# EAGLE design teensy_dev_board (EAGLE 8.2.1)
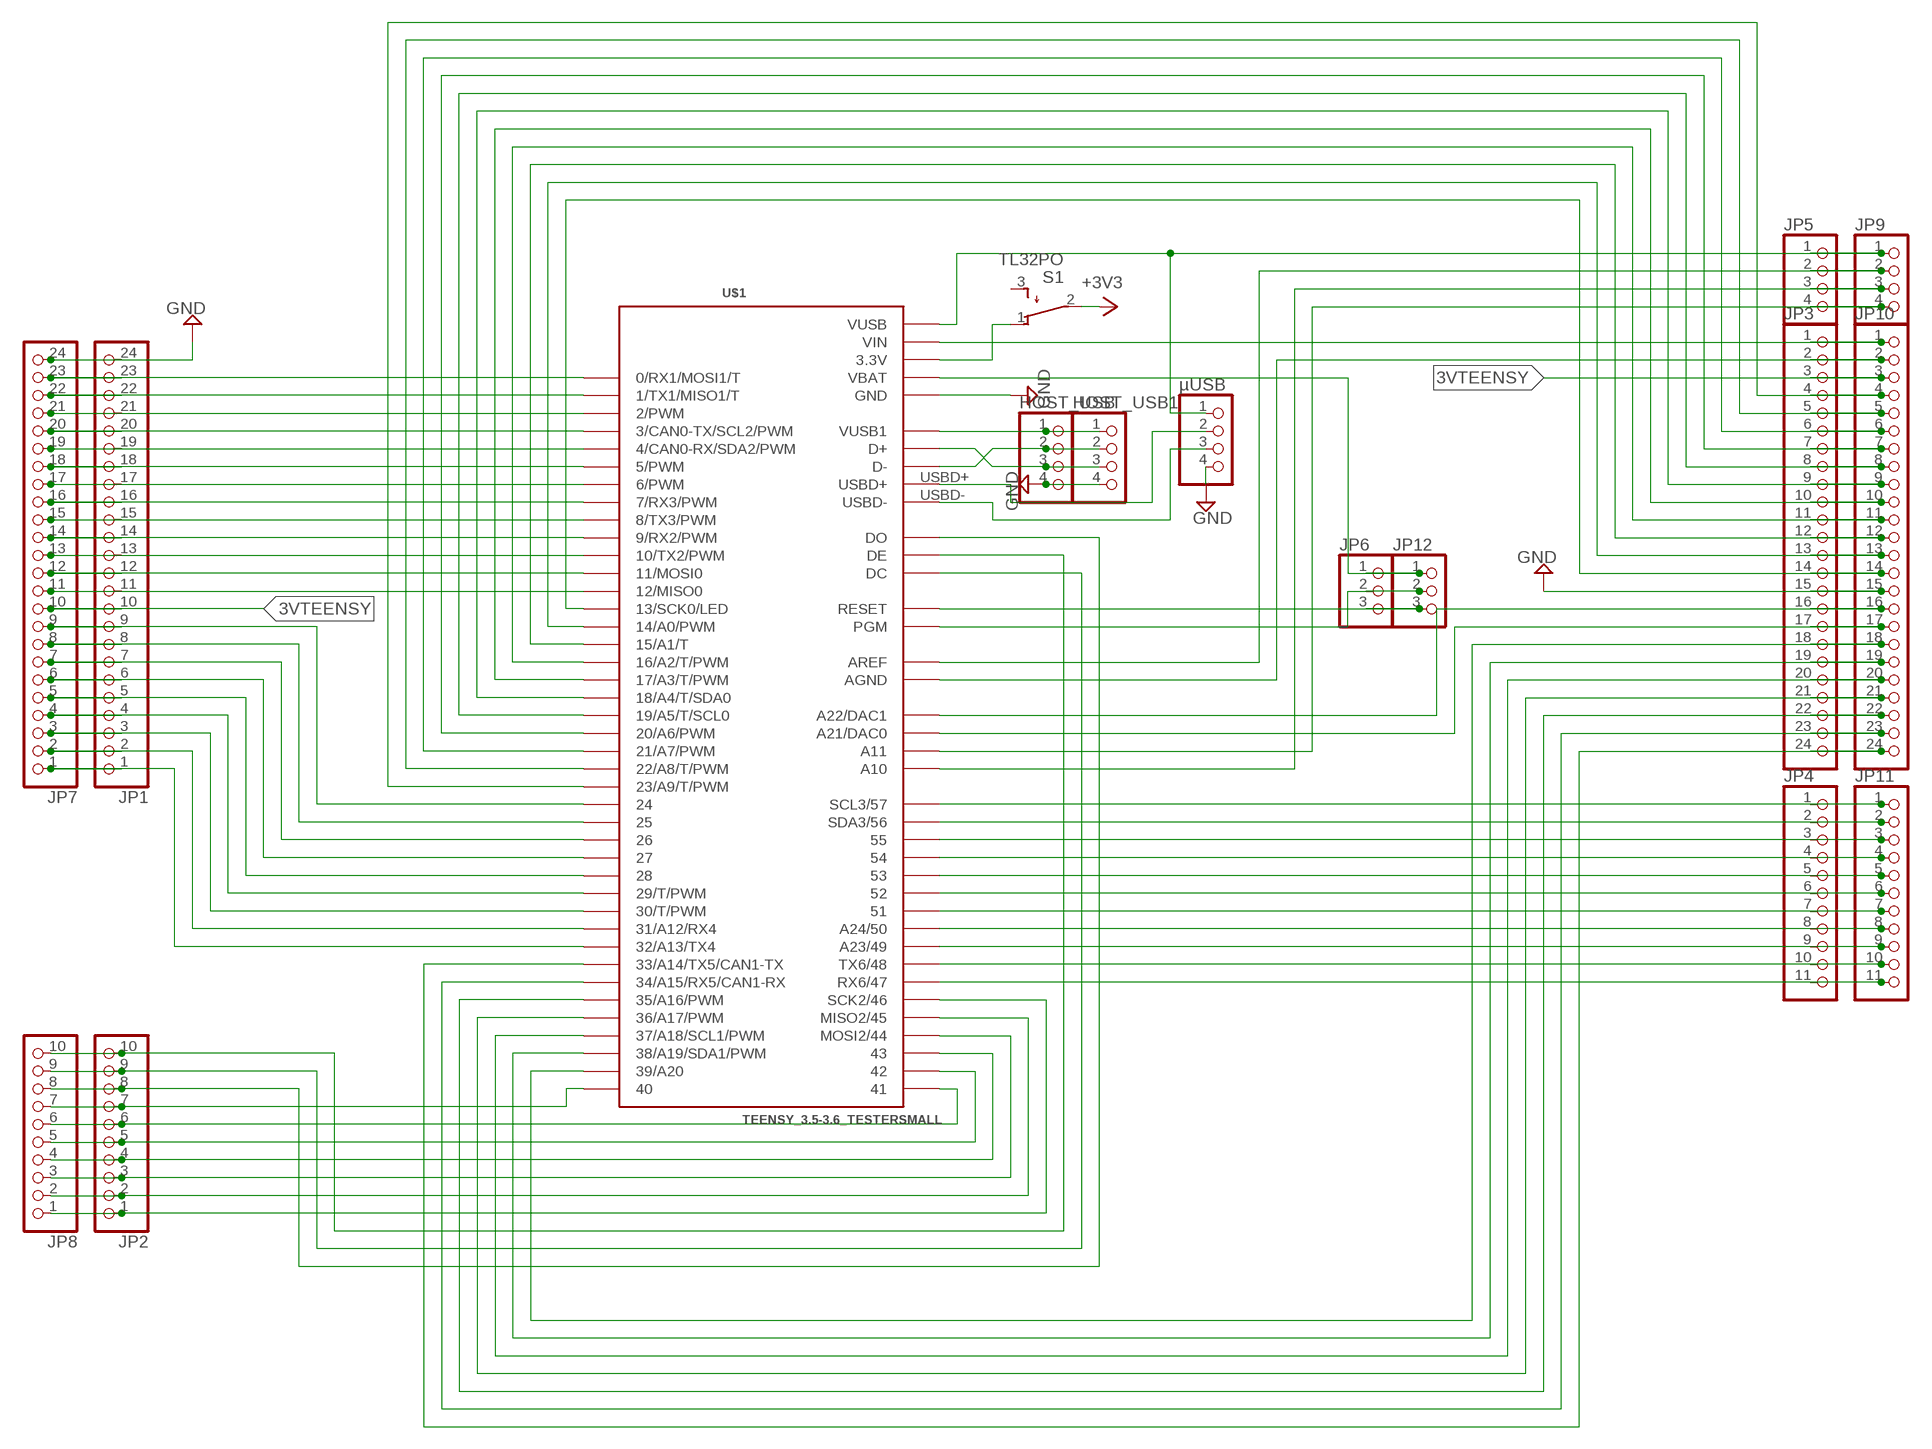
[diagram p0: schematic, sheet 1, part 1 of 2]
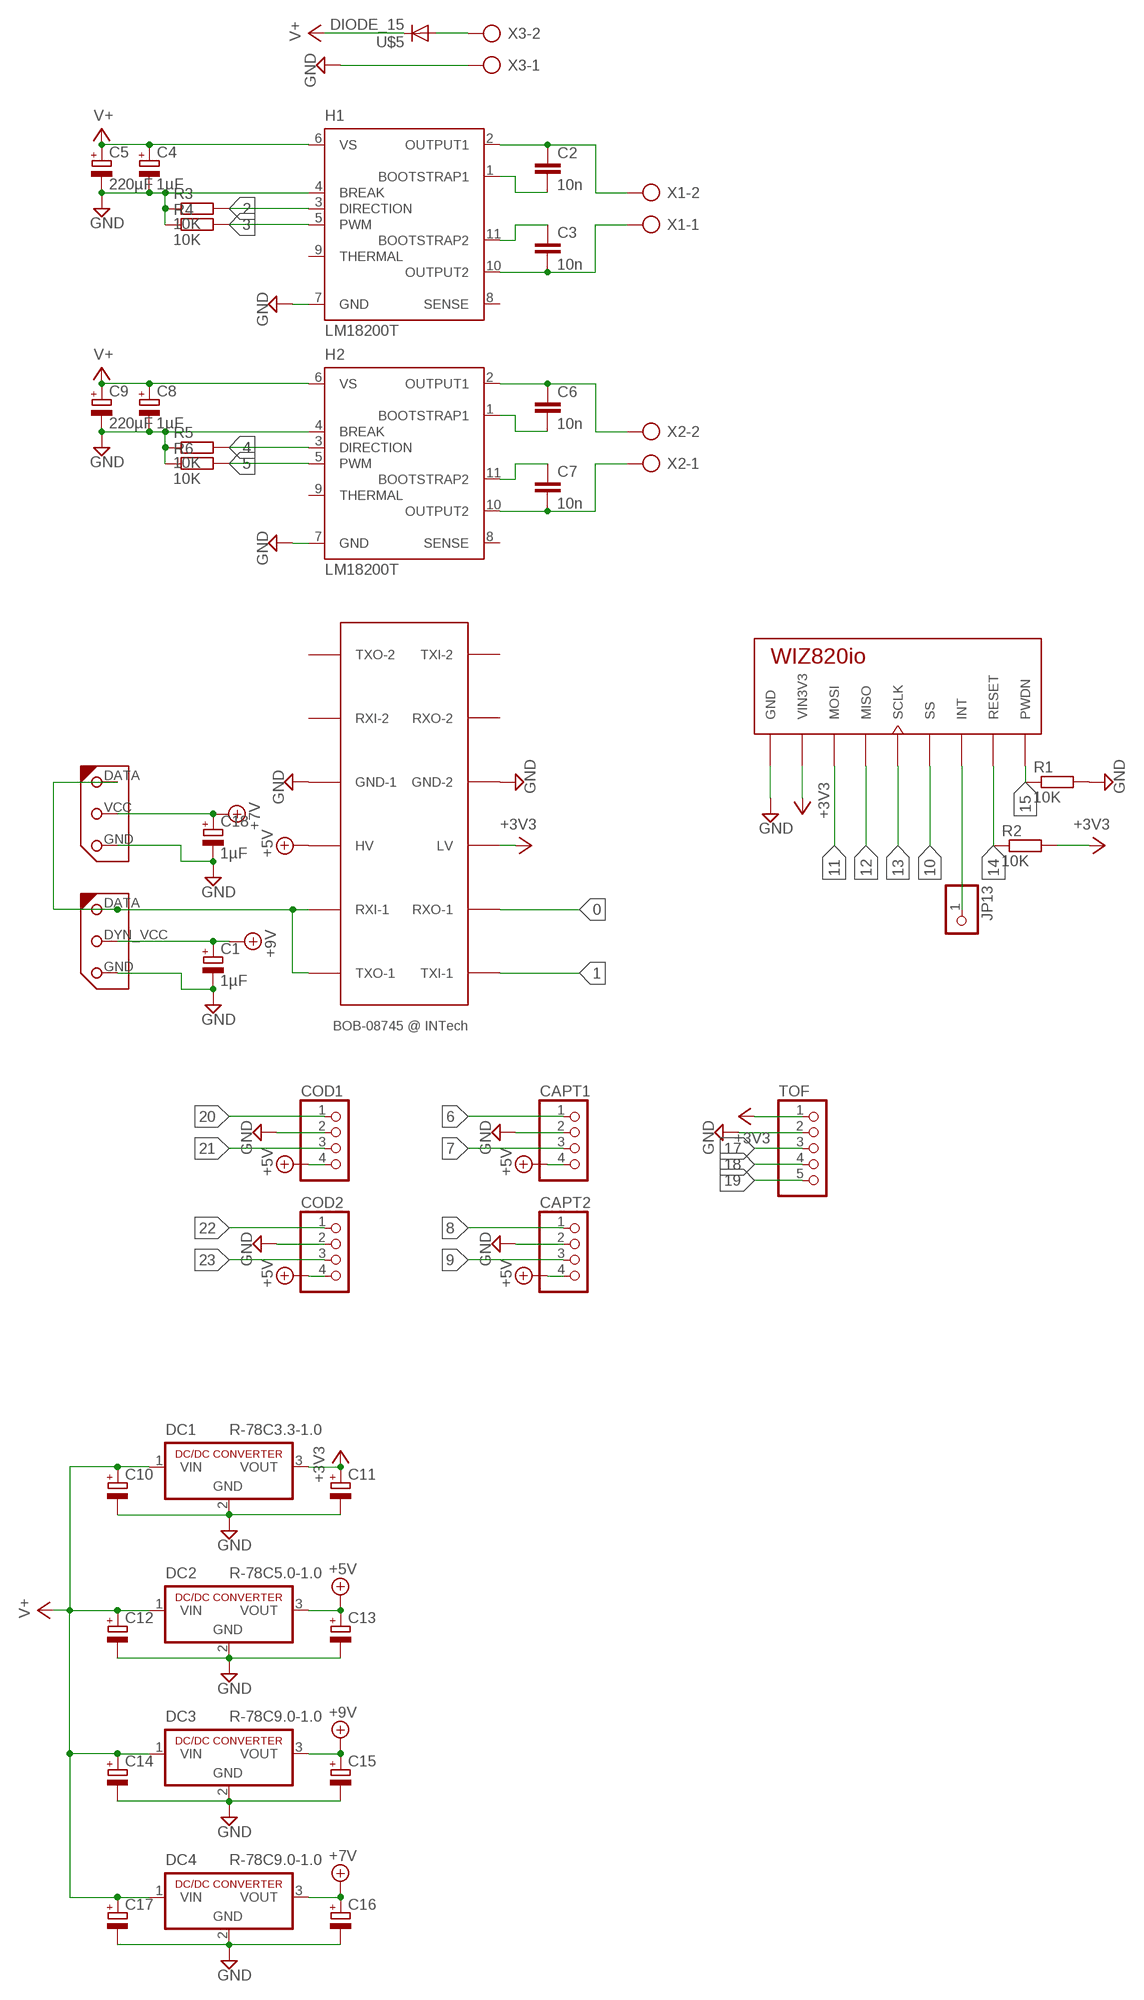
[diagram p1: schematic, sheet 1, part 2 of 2]

## Parts
C1  1µF  CPOL-EUE2,5-6E  [E2,5-6E]
C2  10n  C-EU050-025X075  [C050-025X075]
C3  10n  C-EU050-025X075  [C050-025X075]
C4  1µF  CPOL-EUE2.5-7  [E2,5-7]
C5  220µF  CPOL-EUE2.5-7  [E2,5-7]
C6  10n  C-EU050-025X075  [C050-025X075]
C7  10n  C-EU050-025X075  [C050-025X075]
C8  1µF  CPOL-EUE2.5-7  [E2,5-7]
C9  220µF  CPOL-EUE2.5-7  [E2,5-7]
C10  CPOL-EUE2.5-6  [E2,5-6]
C11  CPOL-EUE2.5-6  [E2,5-6]
C12  CPOL-EUE2.5-6  [E2,5-6]
C13  CPOL-EUE2.5-6  [E2,5-6]
C14  CPOL-EUE2.5-6  [E2,5-6]
C15  CPOL-EUE2.5-6  [E2,5-6]
C16  CPOL-EUE2.5-6  [E2,5-6]
C17  CPOL-EUE2.5-6  [E2,5-6]
C18  1µF  CPOL-EUE2,5-6E  [E2,5-6E]
CAPT1  PINHD-1X4B  [1X04B]
CAPT2  PINHD-1X4B  [1X04B]
COD1  PINHD-1X4B  [1X04B]
COD2  PINHD-1X4B  [1X04B]
DC1  R-78C3.3-1.0  [SIP3]
DC2  R-78C5.0-1.0  [SIP3]
DC3  R-78C9.0-1.0  [SIP3]
DC4  R-78C9.0-1.0  [SIP3]
H1  LM18200T  [TO-220-11]
H2  LM18200T  [TO-220-11]
HOST_USB  PINHD-1X4  [1X04]
HOST_USB1  PINHD-1X4  [1X04]
JP1  PINHD-1X24  [1X24]
JP2  PINHD-1X10  [1X10]
JP3  PINHD-1X24  [1X24]
JP4  PINHD-1X11  [1X11]
JP5  PINHD-1X4  [1X04]
JP6  PINHD-1X3  [1X03]
JP7  PINHD-1X24  [1X24]
JP8  PINHD-1X10  [1X10]
JP9  PINHD-1X4  [1X04]
JP10  PINHD-1X24  [1X24]
JP11  PINHD-1X11  [1X11]
JP12  PINHD-1X3  [1X03]
JP13  PINHD-1X1  [1X01]
R1  10K  R-EU_0204/7  [0204/7]
R2  10K  R-EU_0204/7  [0204/7]
R3  10K  R-EU_0204/7  [0204/7]
R4  10K  R-EU_0204/7  [0204/7]
R5  10K  R-EU_0204/7  [0204/7]
R6  10K  R-EU_0204/7  [0204/7]
S1  TL32PO  [TL3XPO]
TOF  PINHD-1X5B  [1X05B]
U$1  TEENSY_3.5-3.6_TESTERSMALL  [TEENSY_3.5-3.6_TESTER_SMALL]
U$2  BOB-08745  [BOB-08745]
U$3  DYNAMIXEL-1X03AX  [DYNAMIXEL_AX_1X03]
U$4  WIZ820IO  [WIZ820]
U$5  DIODE_15  [DO201-15]
U$6  DYNAMIXEL-1X03XL  [DYNAMIXEL_XL_1X03]
X1  AK300/2  [AK300/2]
X2  AK300/2  [AK300/2]
X3  AK300/2  [AK300/2]
µUSB  PINHD-1X4  [1X04]

## Nets
0: JP1.23 JP7.23 U$1.0(0/RX1/MOSI1/T) U$2.RXO-1
1: JP1.22 JP7.22 U$1.1(1/TX1/MISO1/T) U$2.TXI-1
2: H1.3(DIRECTION) JP1.21 JP7.21 R3.2 U$1.2(2/PWM)
3: H1.5(PWM) JP1.20 JP7.20 R4.2 U$1.3(3/CAN0-TX/SCL2/PWM)
3VTEENSY: JP1.10 JP3.3 JP7.10 JP10.3 S1.1(O) U$1.3.3V U$1.3.3V2(3.3V) U$1.3.3V3(3.3V) U$1.3.3V4(3.3V)
4: H2.3(DIRECTION) JP1.19 JP7.19 R5.2 U$1.4(4/CAN0-RX/SDA2/PWM)
5: H2.5(PWM) JP1.18 JP7.18 R6.2 U$1.5(5/PWM)
6: CAPT1.1 JP1.17 JP7.17 U$1.6(6/PWM)
7: CAPT1.3 JP1.16 JP7.16 U$1.7(7/RX3/PWM)
8: CAPT2.1 JP1.15 JP7.15 U$1.8(8/TX3/PWM)
9: CAPT2.3 JP1.14 JP7.14 U$1.9(9/RX2/PWM)
10: JP1.13 JP7.13 U$1.10(10/TX2/PWM) U$4.SS
11: JP1.12 JP7.12 U$1.11(11/MOSI0) U$4.MOSI
12: JP1.11 JP7.11 U$1.12(12/MISO0) U$4.MISO
13: JP3.14 JP10.14 U$1.13(13/SCK0/LED) U$4.SCLK
14: JP3.13 JP10.13 R2.1 U$1.14/A0(14/A0/PWM) U$4.RESET
15: JP3.12 JP10.12 R1.1 U$1.15/A1(15/A1/T) U$4.PWDN
16: JP3.11 JP10.11 U$1.16/A2(16/A2/T/PWM)
17: JP3.10 JP10.10 TOF.3 U$1.17/A3(17/A3/T/PWM)
18: JP3.9 JP10.9 TOF.4 U$1.18/A4(18/A4/T/SDA0)
19: JP3.8 JP10.8 TOF.5 U$1.19/A5(19/A5/T/SCL0)
20: COD1.1 JP3.7 JP10.7 U$1.20/A6(20/A6/PWM)
21: COD1.3 JP3.6 JP10.6 U$1.21/A7(21/A7/PWM)
22: COD2.1 JP3.5 JP10.5 U$1.22/A8(22/A8/T/PWM)
23: COD2.3 JP3.4 JP10.4 U$1.23/A9(23/A9/T/PWM)
24: JP1.9 JP7.9 U$1.24
25: JP1.8 JP7.8 U$1.25
26: JP1.7 JP7.7 U$1.26
27: JP1.6 JP7.6 U$1.27
28: JP1.5 JP7.5 U$1.28
29: JP1.4 JP7.4 U$1.29(29/T/PWM)
30: JP1.3 JP7.3 U$1.30(30/T/PWM)
31: JP1.2 JP7.2 U$1.31/A12(31/A12/RX4)
32: JP1.1 JP7.1 U$1.32/A13(32/A13/TX4)
33: JP3.24 JP10.24 U$1.33/A14(33/A14/TX5/CAN1-TX)
34: JP3.23 JP10.23 U$1.34/A15(34/A15/RX5/CAN1-RX)
35: JP3.22 JP10.22 U$1.35/A16(35/A16/PWM)
36: JP3.21 JP10.21 U$1.36/A17(36/A17/PWM)
37: JP3.20 JP10.20 U$1.37/A18(37/A18/SCL1/PWM)
38: JP3.19 JP10.19 U$1.38/A19(38/A19/SDA1/PWM)
39: JP3.18 JP10.18 U$1.39/A20
40: JP2.7 JP8.7 U$1.40
41: JP2.6 JP8.6 U$1.41
42: JP2.5 JP8.5 U$1.42
43: JP2.4 JP8.4 U$1.43
44: JP2.3 JP8.3 U$1.44(MOSI2/44)
45: JP2.2 JP8.2 U$1.45(MISO2/45)
46: JP2.1 JP8.1 U$1.46(SCK2/46)
47: JP4.11 JP11.11 U$1.47(RX6/47)
48: JP4.10 JP11.10 U$1.48(TX6/48)
49: JP4.9 JP11.9 U$1.49(A23/49)
50: JP4.8 JP11.8 U$1.50(A24/50)
51: JP4.7 JP11.7 U$1.51
52: JP4.6 JP11.6 U$1.52
53: JP4.5 JP11.5 U$1.53
54: JP4.4 JP11.4 U$1.54
55: JP4.3 JP11.3 U$1.55
56: JP4.2 JP11.2 U$1.56(SDA3/56)
57: JP4.1 JP11.1 U$1.57(SCL3/57)
+3V3: C11.+ DC1.3(VOUT) R2.2 S1.2(P) TOF.1 U$2.LV U$4.VIN1(VIN3V3) U$4.VIN2(VIN3V3)
+5V: C13.+ CAPT1.4 CAPT2.4 COD1.4 COD2.4 DC2.3(VOUT) U$2.HV
+7V: C16.+ C18.+ DC4.3(VOUT) U$6.VCC(DYN_VCC)
+9V: C1.+ C15.+ DC3.3(VOUT) U$3.DYN_VCC
A10: JP5.3 JP9.3 U$1.A10
A11: JP5.4 JP9.4 U$1.A11
AGND: JP3.2 JP10.2 U$1.AGND
AREF: JP5.2 JP9.2 U$1.AREF
D+: HOST_USB1.2 HOST_USB.2 U$1.D-
D-: HOST_USB1.3 HOST_USB.3 U$1.D+
DAC0: JP3.17 JP10.17 U$1.A21(A21/DAC0)
DAC1: JP3.16 JP10.16 U$1.A22(A22/DAC1)
DC: JP2.9 JP8.9 U$1.DC
DE: JP2.10 JP8.10 U$1.DE
DO: JP2.8 JP8.8 U$1.DO
GND: C1.- C4.- C5.- C8.- C9.- C10.- C11.- C12.- C13.- C14.- C15.- C16.- C17.- C18.- CAPT1.2 CAPT2.2 COD1.2 COD2.2 DC1.2(GND) DC2.2(GND) DC3.2(GND) DC4.2(GND) H1.4(BREAK) H1.7(GND) H2.4(BREAK) H2.7(GND) HOST_USB1.4 HOST_USB.4 JP1.24 JP3.15 JP7.24 JP10.15 R1.2 R3.1 R4.1 R5.1 R6.1 TOF.2 U$1.GND U$1.GND1(GND) U$1.GND2(GND) U$1.GND3(GND) U$1.GND4(GND) U$1.GND5(GND) U$1.GND6(GND) U$2.GND-1 U$2.GND-2 U$3.GND U$4.GND1(GND) U$4.GND2(GND) U$4.GND3(GND) U$6.GND X3.1 µUSB.4
N$1: U$2.RXI-1 U$2.TXO-1 U$3.DATA U$6.DATA
N$3: C2.1 H1.2(OUTPUT1) X1.2
N$4: C2.2 H1.1(BOOTSTRAP1)
N$5: C3.2 H1.10(OUTPUT2) X1.1
N$6: C3.1 H1.11(BOOTSTRAP2)
N$8: JP13.1 U$4.INT
N$10: U$5.A(A+) X3.2
N$12: C6.1 H2.2(OUTPUT1) X2.2
N$13: C6.2 H2.1(BOOTSTRAP1)
N$14: C7.2 H2.10(OUTPUT2) X2.1
N$15: C7.1 H2.11(BOOTSTRAP2)
PGM: JP6.2 JP12.2 U$1.PGM
RESET: JP6.3 JP12.3 U$1.RESET
USBD+: U$1.USBD+ µUSB.2
USBD-: U$1.USBD- µUSB.3
V+: C4.+ C5.+ C8.+ C9.+ C10.+ C12.+ C14.+ C17.+ DC1.1(VIN) DC2.1(VIN) DC3.1(VIN) DC4.1(VIN) H1.6(VS) H2.6(VS) U$5.C(C-)
VBAT: JP6.1 JP12.1 U$1.VBAT
VIN: JP3.1 JP10.1 U$1.VIN
VUSB: JP5.1 JP9.1 U$1.VUSB µUSB.1
VUSB1: HOST_USB1.1 HOST_USB.1 U$1.VUSB1
Unconnected: H1.8(SENSE) H1.9(THERMAL) H2.8(SENSE) H2.9(THERMAL) S1.3(S) U$2.RXI-2 U$2.RXO-2 U$2.TXI-2 U$2.TXO-2

## Library data of the parts
C1 C4 C5 C8-C18 = 1NTech_RLCD:CPOL-EU: POLARIZED CAPACITOR, European symbol
C2 C3 C6 C7 = 1NTech_RLCD:C-EU: CAPACITOR, European symbol
CAPT1 CAPT2 COD1 COD2 HOST_USB HOST_USB1 JP5 JP9 µUSB = 1NTech_pinhead:PINHD-1X4: PIN HEADER
DC1-DC4 = dc-dc-converter:R-78C*-1.0: INNOLINE DC/DC-Converter 1.0 AMP SIP3 Single Output Source: Data sheet <http://www.mikrocontroller.net/attachment/150645/157764-da-01-en-DC_DC_WANDLER_R_78C5_0_1_0.pdf>
H1 H2 = national-semiconductor:LM18200T: 3A, 55V H-Bridge Motor Control SourcE: http://cache.national.com/ds/LM/LMD18200.pdf; OC_FARNELL: unknown; OC_NEWARK: unknown
JP1 JP3 JP7 JP10 = 1NTech_pinhead:PINHD-1X24: PIN HEADER
JP2 JP8 = 1NTech_pinhead:PINHD-1X10: PIN HEADER
JP4 JP11 = 1NTech_pinhead:PINHD-1X11: PIN HEADER
JP6 JP12 = 1NTech_pinhead:PINHD-1X3: PIN HEADER
JP13 = 1NTech_pinhead:PINHD-1X1: PIN HEADER
R1-R6 = 1NTech_RLCD:R-EU_: RESISTOR, European symbol
S1 = switch:TL32PO: TINY SWITCH ON - MOM Source: http://www2.produktinfo.conrad.com/datenblaetter/700000-724999/705152-da-01-de-Subminiaturschalter_TL_36YO.pdf
TOF = 1NTech_pinhead:PINHD-1X5: PIN HEADER
U$1 = Teensy_libSG:TEENSY_3.5-3.6_TESTER
U$2 = BOB-08745_CF_INTech:BOB-08745: Convertisseur de niveau logique BOB-08745
U$3 U$6 = 1NTech_pinhead:DYNAMIXEL-1X03
U$4 = WIZnet:WIZ820IO
U$5 = 1NTech_RLCD:DIODE
X1-X3 = con-ptr500:AK300/2: CONNECTOR; OC_FARNELL: unknown; OC_NEWARK: unknown

## Board
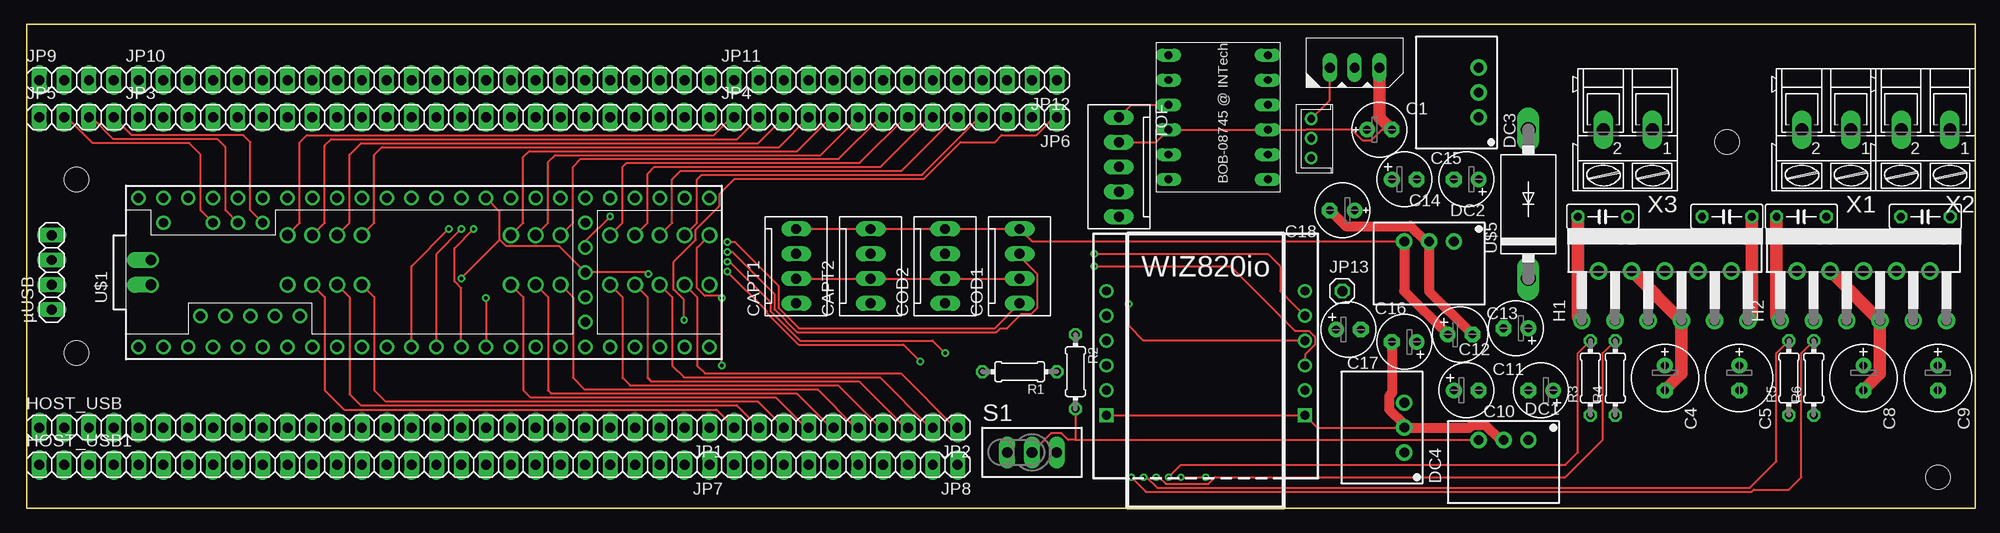
[diagram p2: board, top side]
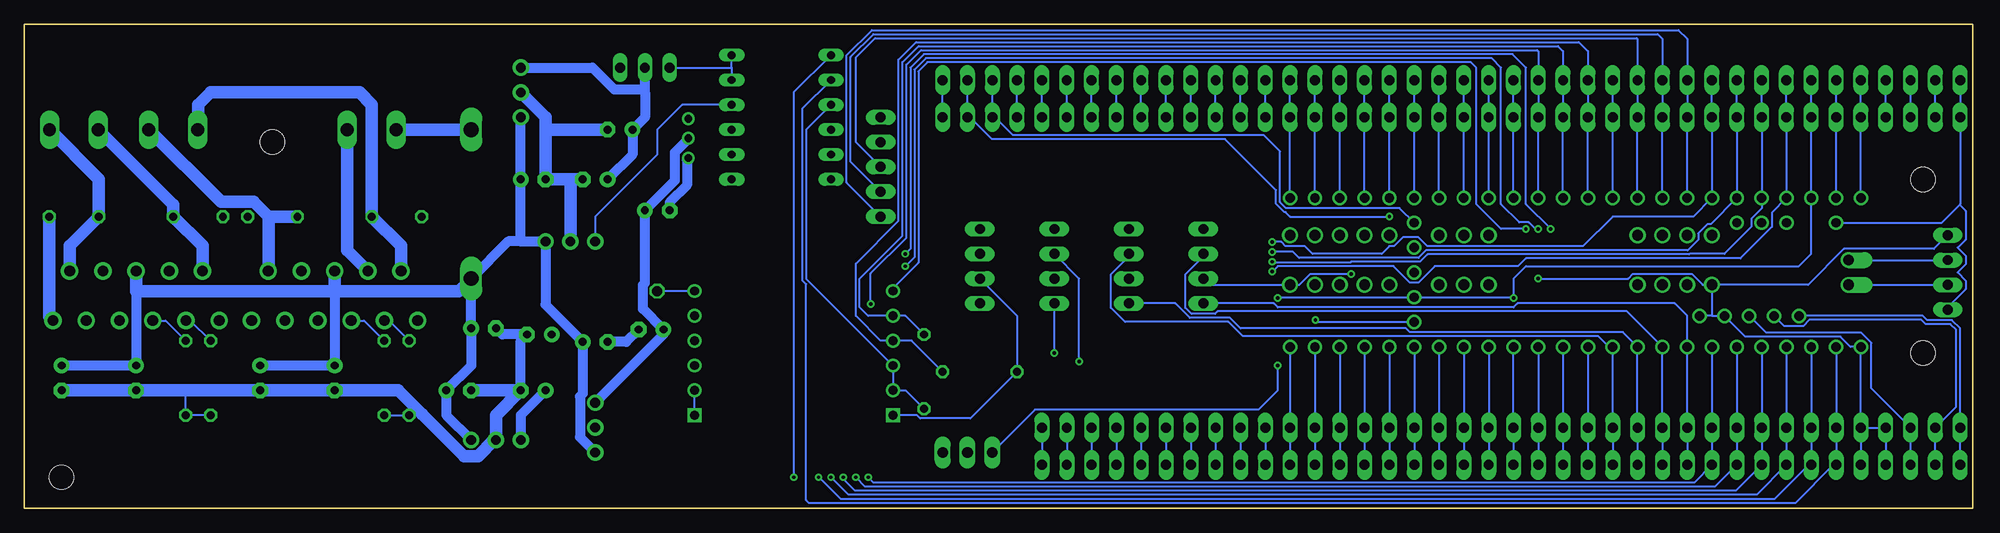
[diagram p3: board, bottom side, seen from below]

Size 199.39 x 49.53 mm. Coordinates in mm from the lower left corner, seen from the top.
Outline: 0,0 199.39,0 199.39,49.53 0,49.53 0,0
Copper layers (1*16): Top 0.035mm / dielectric 1.5mm / Bottom 0.035mm
Design rules "default *": minimum track width 8mil, minimum drill 0.35mm, track to track 8mil, track to pad 8mil, pad to pad 8mil, via to via 8mil, smd to smd 8mil, copper to edge 8mil, drill to drill 8mil, minimum pad ring 10mil, minimum via ring 8mil, stop-mask expansion 4mil, vias tented up to drill 0mil, thermal gap 10mil
Holes 2.5 mm at 173.99,37.49 195.58,3.2 5.08,33.68 5.08,15.9

### Footprints (pad centres in the part's own frame; a part is rotated, then mirrored left to right if it is on the bottom)
E2,5-6E = drill 0.813 pad 1.575: + -1.27,0 | drill 0.813 pad 1.575 octagon: - 1.27,0
C050-025X075 = drill 0.813 octagon: 1 -2.54,0; 2 2.54,0
E2,5-7 = drill 0.813 pad 1.6: + -1.27,0 | drill 0.813 pad 1.6 octagon: - 1.27,0
E2,5-6 = drill 0.813 pad 1.6: + -1.27,0 | drill 0.813 pad 1.6 octagon: - 1.27,0
1X04B = drill 1.016 long: 1 -3.81,0; 2 -1.27,0; 3 1.27,0; 4 3.81,0
SIP3 = drill 1 pad 1.676: 1 -2.54,0; 2 0,0; 3 2.54,0
TO-220-11 = drill 1.1 pad 1.778: 1 -8.5,-9.37; 2 -6.8,-4.29; 3 -5.1,-9.37; 4 -3.4,-4.29; 5 -1.7,-9.37; 6 0,-4.29; 7 1.7,-9.37; 8 3.4,-4.29; 9 5.1,-9.37; 10 6.8,-4.29; 11 8.5,-9.37
1X04 = drill 1.016 long: 1 -3.81,0; 2 -1.27,0; 3 1.27,0; 4 3.81,0
1X24 = drill 1.016 long: 1 -29.21,0; 2 -26.67,0; 3 -24.13,0; 4 -21.59,0; 5 -19.05,0; 6 -16.51,0; 7 -13.97,0; 8 -11.43,0; 9 -8.89,0; 10 -6.35,0; 11 -3.81,0; 12 -1.27,0; 13 1.27,0; 14 3.81,0; 15 6.35,0; 16 8.89,0; 17 11.43,0; 18 13.97,0; 19 16.51,0; 20 19.05,0; 21 21.59,0; 22 24.13,0; 23 26.67,0; 24 29.21,0
1X10 = drill 1.016 long: 1 -11.43,0; 2 -8.89,0; 3 -6.35,0; 4 -3.81,0; 5 -1.27,0; 6 1.27,0; 7 3.81,0; 8 6.35,0; 9 8.89,0; 10 11.43,0
1X11 = drill 1.016 long: 1 -12.7,0; 2 -10.16,0; 3 -7.62,0; 4 -5.08,0; 5 -2.54,0; 6 0,0; 7 2.54,0; 8 5.08,0; 9 7.62,0; 10 10.16,0; 11 12.7,0
1X03 = drill 1.016 long: 1 -2.54,0; 2 0,0; 3 2.54,0
1X01 = drill 1.016 octagon: 1 0,0
0204/7 = drill 0.813 octagon: 1 -3.81,0; 2 3.81,0
TL3XPO = drill 1.1 pad 1.422 long: 1 -2.54,0; 2 0,0; 3 2.54,0
1X05B = drill 1.016 long: 1 -5.08,0; 2 -2.54,0; 3 0,0; 4 2.54,0; 5 5.08,0
TEENSY_3.5-3.6_TESTER_SMALL = drill 0.965: 0 -7.62,26.67; 1 -7.62,24.13; 2 -7.62,21.59; 3 -7.62,19.05; 3.3V 7.62,24.13; 3.3V3 -7.62,-6.35; 3.3V4 -2.54,-16.51; 4 -7.62,16.51; 5 -7.62,13.97; 6 -7.62,11.43; 7 -7.62,8.89; 8 -7.62,6.35; 9 -7.62,3.81; 10 -7.62,1.27; 11 -7.62,-1.27; 12 -7.62,-3.81; 13 7.62,-3.81; 14/A0 7.62,-1.27; 15/A1 7.62,1.27; 16/A2 7.62,3.81; 17/A3 7.62,6.35; 18/A4 7.62,8.89; 19/A5 7.62,11.43; 20/A6 7.62,13.97; 21/A7 7.62,16.51; 22/A8 7.62,19.05; 23/A9 7.62,21.59; 24 -7.62,-8.89; 25 -7.62,-11.43; 26 -7.62,-13.97; 27 -7.62,-16.51; 28 -7.62,-19.05; 29 -7.62,-21.59; 30 -7.62,-24.13; 31/A12 -7.62,-26.67; 32/A13 -7.62,-29.21; 33/A14 7.62,-29.21; 34/A15 7.62,-26.67; 35/A16 7.62,-24.13; 36/A17 7.62,-21.59; 37/A18 7.62,-19.05; 38/A19 7.62,-16.51; 39/A20 7.62,-13.97; A10 5.08,19.05; A11 5.08,16.51; A21 7.62,-11.43; A22 7.62,-8.89; AGND 7.62,26.67; AREF 5.08,21.59; D+ -4.445,17.78; D- -4.445,20.32; GND -7.62,29.21; GND1 7.62,-6.35; GND3 -4.445,15.24; GND4 -4.445,12.7; GND6 0,-16.51; PGM 2.54,-16.51; RESET 5.08,-16.51; VBAT -5.08,-16.51; VIN 7.62,29.21; VUSB 5.08,26.67; VUSB1 -4.445,22.86 | drill 1.1: 3.3V2 3.81,-29.21; 40 -1.27,-8.89; 41 -1.27,-11.43; 42 -1.27,-13.97; 43 -1.27,-19.05; 44 -1.27,-21.59; 45 -1.27,-24.13; 46 -1.27,-26.67; 47 3.81,-26.67; 48 3.81,-24.13; 49 3.81,-21.59; 50 3.81,-19.05; 51 3.81,-13.97; 52 3.81,-11.43; 53 3.81,-8.89; 54 3.81,6.35; 55 3.81,8.89; 56 3.81,11.43; 57 3.81,13.97; DC -1.27,8.89; DE -1.27,11.43; DO -1.27,6.35; GND2 -1.27,13.97; GND5 -1.27,-29.21 | drill 1.1 offset: USBD+ -1.27,27.94; USBD- 1.27,27.94
BOB-08745 = drill 0.8 long: GND-1 1.27,5.08; GND-2 1.27,-5.08; HV -1.27,5.08; LV -1.27,-5.08; RXI-1 -3.81,5.08; RXI-2 3.81,5.08; RXO-1 -3.81,-5.08; RXO-2 3.81,-5.08; TXI-1 -6.35,-5.08; TXI-2 6.35,-5.08; TXO-1 -6.35,5.08; TXO-2 6.35,5.08
DYNAMIXEL_AX_1X03 = drill 1 long: DATA 2.54,0; DYN_VCC 0,0; GND -2.54,0
WIZ820 = drill 0.9 square: GND1 -10.16,0; GND3 10.16,0 | drill 0.9: GND2 -10.16,-2.54; INT -10.16,-12.7; MISO 10.16,-12.7; MOSI -10.16,-5.08; PWDN 10.16,-7.62; RESET 10.16,-10.16; SCLK -10.16,-7.62; SS -10.16,-10.16; VIN1 10.16,-2.54; VIN2 10.16,-5.08
DO201-15 = drill 1.499 long: A 7.62,0; C -7.62,0
DYNAMIXEL_XL_1X03 = drill 0.8: DATA 2,0; GND -2,0; VCC 0,0
AK300/2 = drill 1.321 long: 1 -2.515,0; 2 2.489,0

### Placement (x,y rotation side)
C1  138.43,38.76 0 top
C2  161.29,29.87 180 top
C3  173.99,29.87 180 top
C4  167.64,13.36 270 top
C5  175.26,13.36 270 top
C6  181.61,29.87 180 top
C7  194.31,29.87 180 top
C8  187.96,13.36 270 top
C9  195.58,13.36 270 top
C10  154.94,12.09 180 top
C11  147.32,12.09 0 top
C12  152.4,18.44 180 top
C13  146.69,17.81 0 top
C14  147.32,33.68 180 top
C15  140.97,33.68 0 top
C16  135.25,18.31 0 top
C17  140.97,17.04 180 top
C18  134.62,30.51 180 top
CAPT1  78.74,24.79 90 top
CAPT2  86.36,24.79 90 top
COD1  101.6,24.79 90 top
COD2  93.98,24.79 90 top
DC1  151.13,7.01 180 top
DC2  143.51,27.33 180 top
DC3  148.59,42.57 90 top
DC4  140.97,8.28 90 top
H1  167.64,28.6 0 top
H2  187.96,28.6 0 top
HOST_USB  5.08,8.28 0 top
HOST_USB1  5.08,4.47 0 top
JP1  40.64,8.28 180 top
JP2  83.82,8.28 180 top
JP3  40.64,40.03 0 top
JP4  85.09,40.03 0 top
JP5  5.08,40.03 0 top
JP6  102.87,40.03 180 top
JP7  40.64,4.47 180 top
JP8  83.82,4.47 180 top
JP9  5.08,43.84 0 top
JP10  40.64,43.84 0 top
JP11  85.09,43.84 0 top
JP12  102.87,43.84 180 top
JP13  134.62,22.25 0 top
R1  101.6,14 180 top
R2  107.31,14 270 top
R3  160.02,13.36 90 top
R4  162.56,13.36 90 top
R5  180.34,13.36 90 top
R6  182.88,13.36 90 top
S1  102.87,5.74 0 top
TOF  111.76,34.95 270 top
U$1  40.64,24.16 90 top
U$2  121.92,40.03 270 top
U$3  135.89,45.11 180 top
U$4  120.65,9.55 180 top
U$5  153.67,31.14 90 top
U$6  131.44,37.87 90 top
X1  184.15,38.76 180 top
X2  194.31,38.76 180 top
X3  163.83,38.76 180 top
µUSB  2.54,24.16 90 top

### Tracks (layer width: path | path; a pad name or v marks a point on that pad's centre or on a via)
0
  Bottom 0.203: U$1.0 JP1.23 JP7.23 14.24,4.47 18.15,0.56 119.08,0.56 119.38,0.86 119.38,22.95 119.79,23.35 119.79,40.89 U$2.RXO-1
1  (via drill 0.35)
  Top 0.203: v118.11,3.2 v120.65,3.2
  Bottom 0.203: U$1.1 JP1.22 JP7.22 16.78,4.47 20.29,0.97 115.81,0.97 118.04,3.2 v118.11,3.2 | U$2.TXI-1 120.65,42.57 v120.65,3.2
2  (via drill 0.35)
  Top 0.203: v116.84,3.2 118.11,4.47 157.48,4.47 158.75,5.74 158.75,15.9 R3.2
  Bottom 0.203: U$1.2 JP1.21 JP7.21 22.1,1.42 114.3,1.42 | H1.3 162.08,19.23 R3.2 | 114.3,1.42 114.4,1.42 | 114.3,1.42 115.06,1.42 v116.84,3.2
3  (via drill 0.35)
  Top 0.203: v115.57,3.2 115.87,3.2 116.56,2.52 120.93,2.52 121.62,3.2 157.48,3.2 161.29,7.01 161.29,15.9 R4.2
  Bottom 0.203: U$1.3 JP1.20 JP7.20 24.23,1.83 114.4,1.83 115.57,3 v115.57,3.2 | H1.5 164.62,19.23 R4.2
3VTEENSY  (via drill 0.35)
  Top 0.203: v46.99,21.54 U$1.3.3V3 | U$1.3.3V2 68.58,26.7 68.58,22.56 69.38,21.76 70.9,21.76 v71.12,21.54 v71.12,14.63
  Bottom 0.203: JP7.10 JP1.10 U$1.3.3V3 | JP10.3 JP3.3 U$1.3.3V 16.51,26.06 17.78,24.79 45.72,24.79 46.99,23.52 v46.99,21.54 57.07,21.54 U$1.3.3V4 71.04,21.62 v71.12,21.54 | S1.1 95.96,10.11 73.1,10.11 71.12,12.09 v71.12,14.63
4  (via drill 0.35)
  Top 0.203: v114.3,3.2 114.6,3.2 115.69,2.11 176.35,2.11 179.07,4.83 179.07,15.9 R5.2
  Bottom 0.203: U$1.4 JP1.19 JP7.19 26.36,2.24 113.33,2.24 v114.3,3.2 | H2.3 182.4,19.23 R5.2
5  (via drill 0.35)
  Top 0.203: v113.03,3.2 114.53,1.7 176.52,1.7 176.74,1.93 180.34,1.93 181.61,3.2 181.61,15.9 R6.2
  Bottom 0.203: U$1.5 JP1.18 JP7.18 28.5,2.64 112.47,2.64 v113.03,3.2 | H2.5 184.94,19.23 R6.2
6
  Bottom 0.203: JP7.17 JP1.17 U$1.6 29.21,19.71 30.48,20.98 46.58,20.98 46.99,20.57 71.12,20.57 71.53,20.98 CAPT1.1
7
  Bottom 0.203: JP7.16 JP1.16 U$1.7 35.38,20.17 77.28,20.17 77.54,19.91 79.94,19.91 80.57,20.54 80.57,23.96 78.74,25.79 CAPT1.3
8
  Bottom 0.203: JP7.15 JP1.15 U$1.8 35.79,18.03 57.58,18.03 57.99,18.44 74.93,18.44 76,19.51 80.11,19.51 81.58,20.98 CAPT2.1
9
  Bottom 0.203: JP7.14 JP1.14 U$1.9 37.22,16.54 38.31,17.63 74.69,17.63 76.17,19.1 86.75,19.1 88.19,20.54 88.19,23.96 86.36,25.79 CAPT2.3
10  (via drill 0.35)
  Top 0.203: U$1.10 39.37,24.79 v43.18,28.6 | v109.22,26.06 127,26.06 128.27,24.79 128.27,22.25 U$4.SS
  Bottom 0.203: JP7.13 JP1.13 U$1.10 | v43.18,28.6 45.72,31.14 45.72,45.11 47.09,46.48 107.34,46.48 108.71,45.11 108.71,26.57 v109.22,26.06
11  (via drill 0.35)
  Top 0.203: U$1.11 41.91,26.06 v44.45,28.6 | v109.22,24.79 123.19,24.79 129.8,18.18 131.23,18.18 131.82,17.59 131.82,16.75 130.81,15.74 U$4.MOSI
  Bottom 0.203: JP7.12 JP1.12 U$1.11 | v44.45,28.6 44.75,28.6 45.44,29.28 46.4,29.28 48.26,31.14 48.26,45.11 49.23,46.08 107.14,46.08 108.31,44.91 108.31,25.7 v109.22,24.79
12  (via drill 0.35)
  Top 0.203: U$1.12 44.45,22.55 43.77,23.24 43.77,26.65 v45.72,28.6
  Bottom 0.203: JP7.11 JP1.11 U$1.12 | v45.72,28.6 48.26,28.6 50.8,31.14 50.8,45.11 51.36,45.67 106.97,45.67 107.9,44.74 107.9,25.15 110.49,22.55 U$4.MISO
13  (via drill 0.35)
  Top 0.203: U$4.SCLK 114.3,17.17 112.78,18.69 v112.78,20.93
  Bottom 0.203: U$1.13 JP3.14 JP10.14 44.45,46.79 44.58,46.91 107.62,46.91 109.12,45.42 109.12,27.72 112.78,24.06 v112.78,20.93
14
  Bottom 0.203: U$1.14/A0 JP3.13 JP10.13 41.91,46.79 42.44,47.32 107.87,47.32 109.53,45.67 109.53,27.89 113.89,23.52 113.89,20.57 113.03,19.71 U$4.RESET 109.22,19.71 R2.1
15
  Bottom 0.203: U$1.15/A1 JP3.12 JP10.12 39.37,46.79 40.31,47.73 108.13,47.73 109.93,45.92 109.93,29.43 114.3,25.06 114.3,19.71 111.76,17.17 U$4.PWDN 108.58,17.17 R1.1
16
  Bottom 0.203: U$1.16/A2 JP3.11 JP10.11
17
  Bottom 0.203: U$1.17/A3 JP3.10 JP10.10 34.29,48.06 34.37,48.13 112.33,48.13 114.3,46.16 114.3,37.49 TOF.3
18
  Bottom 0.203: U$1.18/A4 JP3.9 JP10.9 31.75,48.06 32.23,48.54 112.49,48.54 114.82,46.21 114.82,35.47 TOF.4
19
  Bottom 0.203: U$1.19/A5 JP3.8 JP10.8 29.21,48.06 30.1,48.95 112.66,48.95 115.23,46.38 115.23,33.34 TOF.5
20  (via drill 0.35)
  Top 0.203: COD1.1 99.06,18.44 79.01,18.44 76.91,20.54 76.91,22.81 72.44,27.28 v71.68,27.28
  Bottom 0.203: JP10.7 JP3.7 U$1.20/A6 28.57,29.87 36.83,29.87 39.87,26.84 55.82,26.84 56.72,27.74 58.32,27.74 59.22,26.84 59.69,26.84 60.47,26.06 67.56,26.06 68.34,26.84 70.32,26.84 70.76,27.28 v71.68,27.28
21  (via drill 0.35)
  Top 0.203: COD1.3 101.6,25.79 103.43,23.96 103.43,20.54 102.8,19.91 101.8,19.91 100.33,18.44 99.64,18.44 99.23,18.03 78.84,18.03 76.5,20.37 76.5,21.95 72.19,26.26 v71.68,26.26
  Bottom 0.203: JP10.6 JP3.6 U$1.21/A7 26.81,29.1 27.14,29.1 28.08,28.15 28.08,27.5 29.16,26.42 55.96,26.42 56.72,25.65 68.94,25.65 69.55,26.26 v71.68,26.26
22  (via drill 0.35)
  Top 0.203: v71.68,25.25 71.93,25.25 76.1,21.08 76.1,20.2 79.13,17.17 92.71,17.17 v93.98,15.9
  Bottom 0.203: JP10.5 JP3.5 U$1.22/A8 21.59,30.71 22.63,29.67 22.63,28.83 25.4,26.06 28.94,26.06 28.99,26.01 55.79,26.01 56.55,25.25 63.6,25.25 63.65,25.2 71.68,25.2 v71.68,25.25 | v93.98,15.9 COD2.1
23  (via drill 0.35)
  Top 0.203: v71.68,24.23 75.69,20.22 75.69,20.03 78.96,16.76 89.71,16.76 v91.44,15.04
  Bottom 0.203: JP10.4 JP3.4 U$1.23/A9 20.55,30.28 20.55,28.8 23.75,25.6 45.72,25.6 46.53,24.79 55.04,24.79 56.72,23.11 57.58,23.11 59.26,24.79 71.12,24.79 v71.68,24.23 | COD2.3 91.44,23.52 v91.44,15.04
24
  Bottom 0.203: JP7.9 JP1.9 U$1.24
25
  Bottom 0.203: JP7.8 JP1.8 U$1.25
26
  Bottom 0.203: JP7.7 JP1.7 U$1.26
27
  Bottom 0.203: JP7.6 JP1.6 U$1.27
28
  Bottom 0.203: JP7.5 JP1.5 U$1.28
29
  Bottom 0.203: JP7.4 JP1.4 U$1.29
30
  Bottom 0.203: JP7.3 JP1.3 U$1.30
31
  Bottom 0.203: JP7.2 JP1.2 U$1.31/A12
32
  Bottom 0.203: JP7.1 JP1.1 U$1.32/A13
33
  Bottom 0.203: U$1.33/A14 JP3.24 JP10.24
34
  Bottom 0.203: U$1.34/A15 JP3.23 JP10.23
35
  Bottom 0.203: U$1.35/A16 JP3.22 JP10.22
36
  Bottom 0.203: U$1.36/A17 JP3.21 JP10.21
37
  Bottom 0.203: U$1.37/A18 JP3.20 JP10.20
38
  Bottom 0.203: U$1.38/A19 JP3.19 JP10.19
39
  Bottom 0.203: U$1.39/A20 JP3.18 JP10.18
40
  Top 0.203: U$1.40 50.8,21.62 50.8,12.09 51.51,11.38 76.64,11.38 79.74,8.28 JP2.7
  Bottom 0.203: JP2.7 JP8.7
41
  Top 0.203: U$1.41 53.34,21.62 53.34,12.09 53.65,11.79 78.78,11.79 82.28,8.28 JP2.6
  Bottom 0.203: JP2.6 JP8.6
42
  Top 0.203: U$1.42 55.88,21.62 55.88,13.36 57.05,12.19 80.91,12.19 84.82,8.28 JP2.5
  Bottom 0.203: JP2.5 JP8.5
43
  Top 0.203: U$1.43 60.96,21.62 60.96,13.36 61.72,12.6 83.04,12.6 87.36,8.28 JP2.4
  Bottom 0.203: JP2.4 JP8.4
44
  Top 0.203: U$1.44 63.5,21.62 63.5,13.36 63.86,13 85.18,13 89.9,8.28 JP2.3
  Bottom 0.203: JP2.3 JP8.3
45
  Top 0.203: U$1.45 66.04,21.62 66.04,14.63 67.26,13.41 87.31,13.41 92.44,8.28 JP2.2
  Bottom 0.203: JP2.2 JP8.2
46
  Top 0.203: U$1.46 68.58,21.62 68.58,14.63 69.39,13.82 89.44,13.82 94.98,8.28 JP2.1
  Bottom 0.203: JP2.1 JP8.1
47
  Top 0.203: U$1.47 68.58,29.24 68.58,33.68 69.04,34.14 91.63,34.14 97.52,40.03 JP4.11
  Bottom 0.203: JP4.11 JP11.11
48
  Top 0.203: U$1.48 66.04,29.24 66.04,33.68 66.9,34.54 89.49,34.54 94.98,40.03 JP4.10
  Bottom 0.203: JP4.10 JP11.10
49
  Top 0.203: U$1.49 63.5,29.24 63.5,34.24 64.21,34.95 87.36,34.95 92.44,40.03 JP4.9
  Bottom 0.203: JP4.9 JP11.9
50
  Top 0.203: U$1.50 60.96,29.24 60.96,34.95 61.37,35.36 85.23,35.36 89.9,40.03 JP4.8
  Bottom 0.203: JP4.8 JP11.8
51
  Top 0.203: U$1.51 55.88,29.24 55.88,34.95 56.69,35.76 83.09,35.76 87.36,40.03 JP4.7
  Bottom 0.203: JP4.7 JP11.7
52
  Top 0.203: U$1.52 53.34,29.24 53.34,35.46 54.05,36.17 81.23,36.17 JP4.6
  Bottom 0.203: JP4.6 JP11.6
53
  Top 0.203: U$1.53 50.8,29.24 50.8,35.97 51.41,36.58 78.83,36.58 82.28,40.03 JP4.5
  Bottom 0.203: JP4.5 JP11.5
54
  Top 0.203: U$1.54 35.56,29.24 35.56,36.22 36.32,36.98 76.96,36.98 JP4.4
  Bottom 0.203: JP4.4 JP11.4
55
  Top 0.203: U$1.55 33.02,29.24 33.02,36.22 34.19,37.39 74.83,37.39 JP4.3
  Bottom 0.203: JP4.3 JP11.3
56
  Top 0.203: U$1.56 30.48,29.24 30.48,37.16 31.11,37.8 72.69,37.8 JP4.2
  Bottom 0.203: JP4.2 JP11.2
57
  Top 0.203: U$1.57 27.94,29.24 27.94,37.49 28.65,38.2 70.29,38.2 72.12,40.03 JP4.1
  Bottom 0.203: JP4.1 JP11.1
+3V3
  Top 0.203: 107.31,7.01 106.56,7.01 105.88,7.7 104.83,7.7 S1.2 | 107.31,7.01 DC1.3 | TOF.1 113.03,41.3 U$2.LV | R2.2 107.31,7.01
  Bottom 0.203: U$2.LV 119.38,38.76 119.38,23.52 U$4.VIN2 U$4.VIN1 109.22,12.09 R2.2
  Bottom 1.016: DC1.3 148.59,9.55 C11.+
+5V
  Top 0.203: CAPT1.4 CAPT2.4 COD2.4 COD1.4 102.87,27.33 DC2.3
  Top 1.016: DC2.3 140.97,22.25 C13.+
  Bottom 0.203: U$2.HV 132.08,41.3 134.62,38.76 134.62,36.22 140.97,29.87 DC2.3
+7V
  Bottom 1.016: DC4.3 133.99,17.81 C16.+ 136.09,20.42 136.09,22.86 135.89,23.06 C18.+ 132.81,33.59 132.81,36.44 131.44,37.8 U$6.VCC
+9V
  Bottom 1.016: 135.89,42.57 U$3.DYN_VCC | 135.89,42.57 135.89,40.03 C1.+ 137.16,36.22 C15.+ | DC3.3 141.26,45.11 139.04,42.89 136.21,42.89 135.89,42.57
A10
  Top 0.203: U$1.A10 20.32,30.51 20.32,36.98 19.51,37.8 8.86,37.8 6.62,40.03 JP5.3
  Bottom 0.203: JP5.3 JP9.3
A11
  Top 0.203: U$1.A11 22.86,30.51 22.86,37.49 22.15,38.2 10.72,38.2 JP5.4
  Bottom 0.203: JP5.4 JP9.4
AGND
  Bottom 0.203: U$1.AGND JP3.2 JP10.2
AREF
  Top 0.203: U$1.AREF 17.78,30.51 17.78,36.22 16.61,37.39 6.72,37.39 4.08,40.03 JP5.2
  Bottom 0.203: JP5.2 JP9.2
D+
  Bottom 0.203: HOST_USB1.2 HOST_USB.2 1.68,10.41 1.68,18.27 2.28,18.87 4.82,18.87 5.25,19.3 16.71,19.3 17.35,18.67 19.28,18.67 U$1.D-
D-
  Bottom 0.203: HOST_USB1.3 HOST_USB.3 10.36,12.29 10.36,16.94 11.4,17.98 21.13,17.98 U$1.D+
DAC0
  Bottom 0.203: U$1.A21 JP3.17 JP10.17
DAC1
  Bottom 0.203: U$1.A22 JP3.16 JP10.16
DC
  Top 0.203: U$1.DC 33.02,21.62 33.02,11.68 34.14,10.57 72.64,10.57 JP2.9
  Bottom 0.203: JP2.9 JP8.9
DE
  Top 0.203: U$1.DE 30.48,21.62 30.48,12.09 32.46,10.11 70.56,10.11 JP2.10
  Bottom 0.203: JP2.10 JP8.10
DO
  Top 0.203: U$1.DO 35.56,21.62 35.56,12.09 36.68,10.97 74.78,10.97 JP2.8
  Bottom 0.203: JP2.8 JP8.8
GND  (via drill 0.35)
  Top 0.203: CAPT1.2 CAPT2.2 COD2.2 COD1.2 | 57.17,24.18 U$1.GND6 | v63.6,23.98 63.42,24.16 U$1.GND6 | U$1.GND6 54.47,26.84 49.06,26.84 48.4,27.5 | U$1.GND1 48.4,30.37 48.4,27.5 | 48.4,27.5 44.45,23.55 v44.45,23.52 | 138.25,39.85 138.43,40.03 | U$4.GND3 U$4.GND1 132.08,8.28 DC4.2 | TOF.2 115.57,37.49 U$2.GND-2 U$2.GND-1 130.98,38.76 131.05,38.83 135.55,38.83 136.71,37.67 137.61,37.67 138.71,38.76 C1.-
  Top 1.016: C13.- 143.51,22.25 DC2.2 143.16,27.33 141.61,28.88 134.98,28.88 C18.- | DC1.2 150.78,7.01 149.23,8.56 147.95,8.56 147.67,8.28 DC4.2 140.97,8.63 139.42,10.18 139.42,11.46 139.7,11.74 C17.-
  Top 1.27: H1.4 169.32,19.23 H1.7 169.34,13.79 C4.- | H2.4 189.64,19.23 H2.7 189.66,13.79 C8.- | U$3.GND 138.43,40.03 C1.-
  Bottom 0.203: JP1.24 U$1.GND 12.5,16.54 13.54,17.58 23.27,17.58 U$1.GND3 26.67,19.71 | JP1.24 JP7.24 | HOST_USB1.4 HOST_USB.4 JP1.24 | U$1.GND1 JP3.15 JP10.15 | 26.67,19.71 U$1.GND4 | U$1.GND2 26.67,19.71 | 158.66,9.64 158.75,9.55 R3.1 R4.1 | R5.1 R6.1 182.88,12.09 | CAPT1.2 78.11,22.89 U$1.GND5 68.91,22.89 67.78,24.02 63.77,24.02 v63.6,23.98 | µUSB.4 3.95,26.56 13.17,26.56 16.84,22.89 U$1.GND2 | U$1.GND2 27.61,22.89 28.74,24.02 34.76,24.02 35.25,23.52 v44.45,23.52 | U$4.GND1 U$4.GND2 | COD1.2 97.79,19.71 R1.2 102.56,9.22 107.72,9.22 108.05,9.55 U$4.GND3
  Bottom 1.016: C12.- 150.5,17.81 C13.- 148.59,17.17 C11.- | U$6.GND 131.59,35.73 131.59,33.08 133.35,31.32 C18.- | C16.- 137.79,17.04 C17.-
  Bottom 1.27: X3.1 166.34,26.42 H1.4 | C9.- C8.- 182.88,12.09 C5.- C4.- 161.12,12.09 158.66,9.64 154.36,5.33 152.98,5.33 151.3,7.01 DC1.2 151.13,9.55 C11.- C10.- | DC2.2 143.51,33.68 | 143.51,33.68 C15.- | 143.51,33.68 C14.- 146.05,38.76 | 146.05,38.76 146.05,40.03 DC3.2 | C1.- 146.05,38.76
N$1
  Top 0.203: U$6.DATA 133.35,41.78 U$3.DATA
  Bottom 0.203: 127,45.11 U$2.RXI-1 | 127,45.11 U$2.TXO-1 | U$3.DATA 127,45.11
N$3
  Bottom 1.27: H1.2 160.84,26.88 C2.1 163.83,41.3 165.1,42.57 180.34,42.57 181.61,41.3 181.61,38.81 X1.2
N$4
  Top 1.27: H1.1 158.75,19.62 C2.2
N$5
  Bottom 1.27: X1.1 179.27,31.37 175.91,31.37 174.41,29.87 | 174.41,29.87 C3.2 | H1.10 174.41,24.34 174.41,29.87
N$6
  Top 1.27: H1.11 176.53,19.62 C3.1
N$8
  Bottom 0.203: U$4.INT JP13.1
N$10
  Bottom 1.27: X3.2 U$5.A
N$12
  Bottom 1.27: H2.2 181.16,26.88 C6.1 184.15,31.09 X2.2
N$13
  Top 1.27: H2.1 179.07,19.62 C6.2
N$14
  Bottom 1.27: H2.10 194.76,26.88 C7.2 191.77,33.71 X2.1
N$15
  Bottom 1.27: H2.11 196.85,19.62 C7.1
PGM  (via drill 0.35)
  Top 0.203: v59.69,29.87 57.15,27.33 U$1.PGM
  Bottom 0.203: JP12.2 JP6.2 102.6,40.03 100.36,37.8 76.5,37.8 71.3,32.59 71.3,31.18 70.45,30.33 70.31,30.33 69.85,29.87 v59.69,29.87
RESET
  Bottom 0.203: JP12.3 JP6.3 100.06,40.03 98.23,38.2 72.54,38.2 70.89,36.55 70.89,31.34 70.28,30.73 58.65,30.73 U$1.RESET
USBD+
  Bottom 0.203: U$1.USBD+ µUSB.2
USBD-
  Bottom 0.203: U$1.USBD- µUSB.3
V+
  Bottom 1.016: 167.64,22.25 C4.+ C5.+ | 187.96,22.25 C8.+ C9.+ | DC1.1 156.21,9.55 C10.+ 153.67,14.63 C12.+ U$5.C 149.86,27.33 148.59,27.33 | 148.59,27.33 DC2.1 146.05,20.85 C17.+ 142.24,11.74 142.52,11.46 142.52,7.29 DC4.1 | 148.59,27.33 C14.+ DC3.1
  Bottom 1.27: U$5.C 154.94,22.25 167.64,22.25 | 167.64,22.25 H1.6 | 167.64,22.25 187.96,22.25 H2.6
VBAT  (via drill 0.35)
  Top 0.203: JP6.1 105.14,40.03 103.31,38.2 99.77,38.2 99.06,37.49 95.56,37.49 91.8,33.73 72.44,33.73 70.89,32.18 70.89,30.97 68.44,28.52 68.44,27.5 66.18,25.24 66.18,22.42 67.26,21.34 v67.26,19.3
  Bottom 0.203: JP6.1 JP12.1 | U$1.VBAT 67.03,19.08 v67.26,19.3
VIN
  Bottom 0.203: U$1.VIN JP3.1 JP10.1
VUSB
  Bottom 0.203: JP9.1 JP5.1 1.27,31.14 1.34,31.07 | µUSB.1 2.54,20.61 0.71,22.44 0.71,23.33 1.54,24.16 0.71,24.98 0.71,25.87 1.54,26.7 0.71,27.52 0.71,30.45 1.34,31.07 | U$1.VUSB 3.17,29.24 1.34,31.07
VUSB1
  Bottom 0.203: HOST_USB1.1 HOST_USB.1 1.27,18.44 2.11,19.28 4.65,19.28 5.08,19.71 U$1.VUSB1

### Text on the board
Document: VUSB | AREF | AGND | DAC1 | DAC0 | RESET | PGM | VBAT | MOTORS | A10 | A11 | VIN | 3V3 | 23 | 22 | 21 | 20 | 19 | 18 | 17 | 16 | 15 | 14 | 13 | 39 | 38 | 37 | 36 | 35 | 34 | 33 | 57 | 56 | 55 | 54 | 53 | 52 | 51 | 50 | 49 | 48 | 47 | TX1 | Vin / 11-24V | AX12 | RX1 | TOF | +9V | BOB-11978 | 3V3 | XL320 | #3ioA | #3ioB | #4ioA | #4ioB | SCL | SDA | EN | RST | SCLK | GND | GND | PWDN | EN | SDA | #1 | #2 | #3 | #4 | SCL | H1 | H2 | GND | 5V | 5V | io A | io A | D- | Teensy 3.5 - 3.6 | USB | +5V | GND | GND | D+ | MISO | INT | io B | io B | 5V | RST | SS | PWDN | SCLK | MOSI | USB HOST | RX1 | TX1 | H1 DIR | H1PWM | H2 DIR | H2PWM | #1ioB | #1ioA | #2ioB | #2ioA | SS | MOSI | MISO | 5V | D+ | D- | GND | +7.4V | +3.3V | TEENSY SWITCH | 0 | 1 | 2 | 3 | 4 | 5 | 6 | 7 | 8 | 9 | 10 | 11 | 12 | 24 | 25 | 26 | 27 | 28 | 29 | 30 | 31 | 32 | DE | DC | DO | 40 | 41 | 42 | 43 | 44 | 45 | 46